# Altium schematic sheet Sheet4.SchDoc (part 2 of 3)
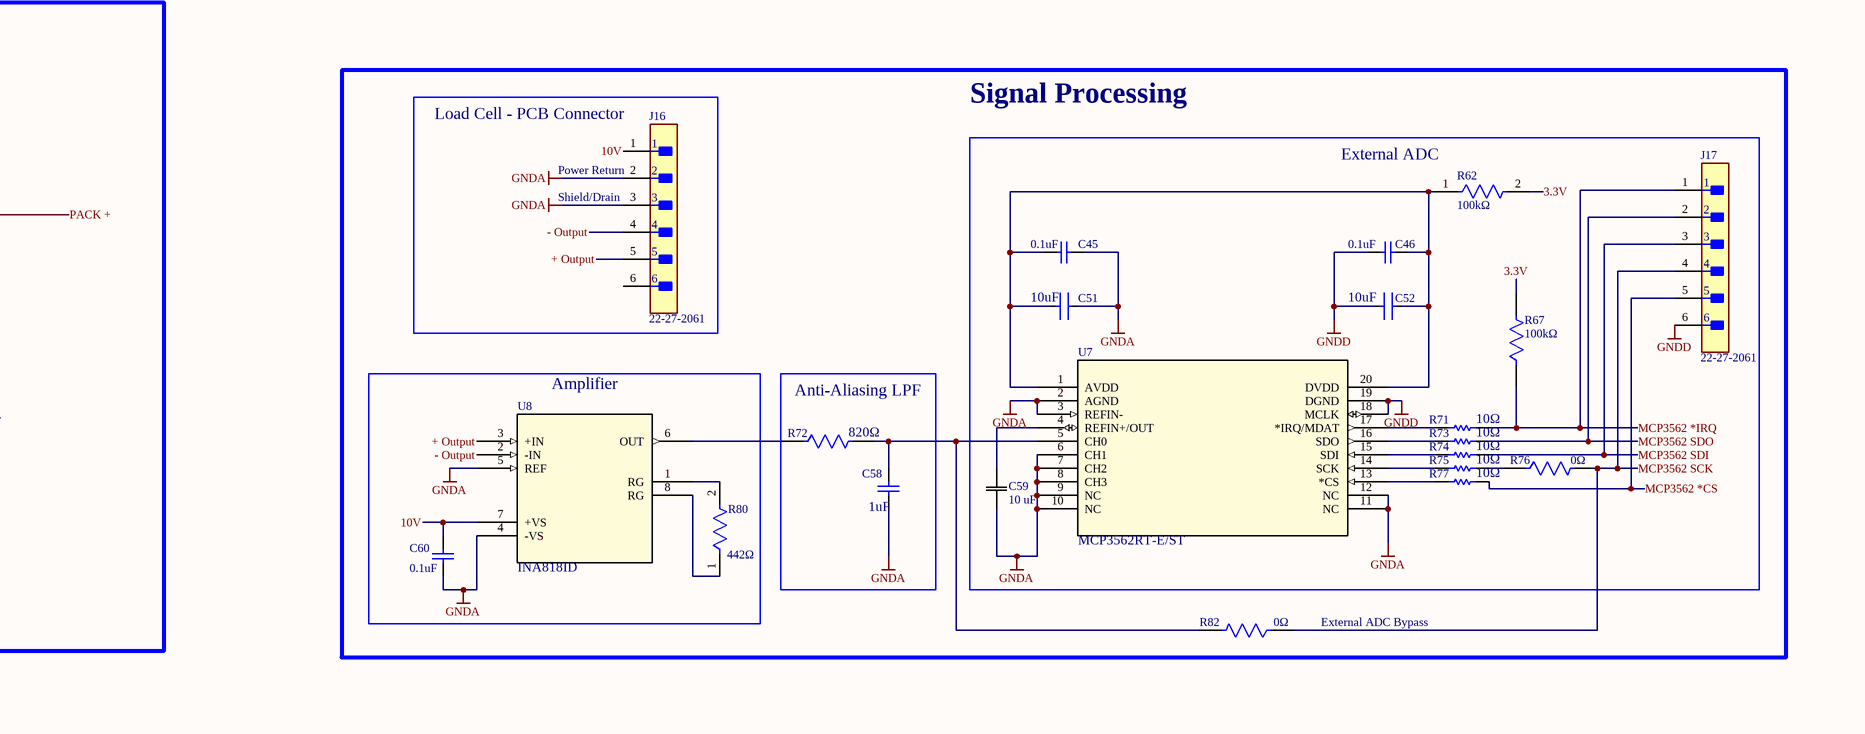
[diagram p4: Sheet4.SchDoc, bottom right]
## Library data of the parts
C1 = CMP-2007-00089-2: Ceramic Capacitor for Automotive 470nF  ±10% 25VDC X7R 0805 Paper T/R; Voltage Rating: 25V; Mount: Surface Mount; Max Operating Temperature: 125°C; Package Quantity: 1; Packaging: Tape and Reel; Height: 0.85mm; Dielectric: X7R; Case Code (Metric): 2012; Tolerance: 10%; Termination: SMD/SMT; Lead Free: Lead Free; Thickness: 0.037inch; Case Code (Imperial): 0805; Min Operating Temperature: -55°C; Length: 2mm; Capacitance: 470nF; Ratings: AEC-Q200; Radiation Hardening: No; Depth: 1.25mm; Voltage Rating (DC): 25V; Case/Package: 0805; Width: 0.049inch
C2 C12 = CMP-2007-00512-2: CAP CER 100PF 100V C0G/NP0 0805; Manufacturer Part Number: C0805C101J1GACAUTO; Manufacturer: KEMET; Tolerance: 0.05; Temperature Coefficient: 30ppm/°C; Temperature Characteristic: C0G; Material: Ceramic; Digikey Description: CAP CER 100PF 100V C0G/NP0 0805; Automotive: No; Value: 100 pF; Temperature: -55°C to +125°C; Ipc Land Pattern Name: CAPC200125X78; Device Class L1: Passive Components; Package: C0805C-DN; Category: Cap; Temperature Range Low: -55°C; Temperature Range High: +125°C; ComponentLink2URL: https://content.kemet.com/datasheets/KEM_C1003_C0G_SMD.pdf; Octopart: https://octopart.com/c0805c101j1gacauto-kemet-22884341; ComponentLink2Description: Datasheet; RoHS: TRUE; Capacitance: 100 pF; Lead Free: Yes; Height: 0.88mm; Voltage Rating: 100 V; Device Class L2: Capacitors; Device Class L3: Ceramic Capacitors
C3 = CMP-2000-06049-2: Multilayer Ceramic Capacitors 1uF ±10% 100V X7R SMD 1206; Construction: Flat; Voltage Rating (DC): 100V; Tolerance: 10%; Package Quantity: 1; Lead Free: Lead Free; Termination: SMD/SMT; Mount: Surface Mount; Capacitance: 1uF; Case Code (Metric): 3216; REACH SVHC: No SVHC; Thickness: 0.051inch; Voltage Rating: 100V; Height: 1.6mm; Case Code (Imperial): 1206; Packaging: Tape and Reel; RoHS Compliant: Yes; Weight: 0.000571oz; Min Operating Temperature: -55°C; Case/Package: 1206; Width: 0.063inch; Length: 3.2mm; Max Operating Temperature: 125°C; Series: C; Dielectric: X7R; Voltage: 100V; Depth: 1.6mm; Resistor Type: Ceramic; Contact Plating: Tin
C4 C43 = EMK212B7225KG-T: Description; Manufacturer_Name: TAIYO YUDEN; Copyright: Copyright (C) 2025 Ultra Librarian. All rights reserved.; Manufacturer_Part_Number: EMK212B7225KG-T; Supplier 1: Future Electronics; Supplier Part Number 1: 8043977
C5 C6 C8-C10 = CMP-08246-004834-1: Multilayer Ceramic Capacitors 220nF ±10% 50V X7R SMD 0805; Dielectric: X7R; Weight: 0.000194oz; Termination: SMD/SMT; Resistor Type: Ceramic; Case Code (Metric): 2012; Number of Pins: 2; Capacitance: 220nF; REACH SVHC: No SVHC; Dielectric Material: Ceramic; Min Operating Temperature: -55°C; Depth: 1.25mm; Max Operating Temperature: 125°C; Voltage: 50V; Case Code (Imperial): 0805; Thickness: 0.057inch; Mount: Surface Mount; Voltage Rating (DC): 50V; Length: 2mm; Tolerance: 10%; Packaging: Tape and Reel; Package Quantity: 1; Case/Package: 0805; Radiation Hardening: No; Voltage Rating: 50V; Height: 1.25mm; Width: 0.049inch; Series: C; Construction: Flat; RoHS Compliant: Yes; Lead Free: Lead Free
C7 = EMK212B7105KG-T: No Description Available; Manufacturer_Name: TAIYO YUDEN; Copyright: Copyright (C) 2026 Ultra Librarian. All rights reserved.; Manufacturer_Part_Number: EMK212B7105KG-T; Supplier 1: DigiKey; Supplier Part Number 1: 587-1283-1-ND
C11 = CMP-2007-00334-2: CAP CER 0.022UF 16V X7R 0805; Manufacturer Part Number: C0805C223K4RACTU; Manufacturer: KEMET; Capacitance: 22,000 pF; Value: 22,000 pF; Temperature Coefficient: 30ppm/°C; Tolerance: 0.1; Material: Ceramic; Octopart: https://octopart.com/c0805c223k4ractu-kemet-16264534; ComponentLink2URL: https://content.kemet.com/datasheets/KEM_C1003_C0G_SMD.pdf; Digikey Description: CAP CER 0.022UF 16V X7R 0805; Mouser Description: Cap Ceramic 0.022uF 16V X7R 10% SMD 0805 125°C Paper T/R; Temperature Characteristic: X7R; Device Class L3: Ceramic Capacitors; ComponentLink2Description: Datasheet; Temperature Range High: +125°C; Temperature Range Low: -55°C; Category: Cap; Package: C0805C-DN; Automotive: No; Height: 0.88mm; Lead Free: Yes; Voltage Rating: 16 V; Temperature: -55°C to +125°C; Ipc Land Pattern Name: CAPC200125X78; RoHS: TRUE; Device Class L2: Capacitors; Device Class L1: Passive Components
C13 C15 C16 C18-C20 = CMP-06035-027865-1: Multilayer Ceramic Capacitors MLCC - SMD/SMT 0805 0.1uF 10%, 100VDC,  X7R 15%
C14 = CL32A226KAJNNNE: Capacitor: ceramic; MLCC; 22uF; 25V; X5R; Â±10%; SMD; 1210; -55Ã·85Â°C; MF: Samsung Electro-Mechanics; SnapEDA_Link: https://www.snapeda.com/parts/CL32A226KAJNNNE/Samsung/view-part/?ref=snap; Package: SMD-2 Samsung; Value: *; MP: CL32A226KAJNNNE; Check_prices: https://www.snapeda.com/parts/CL32A226KAJNNNE/Samsung/view-part/?ref=eda; Supplier 1: Avnet; Supplier Part Number 1: CL32A226KAJNNNE
C17 = CL31B225KAHNNNE: Manufacturer_Name: Samsung; Part Reference: C6; PCB Footprint: CAP_CL31_SAM; Copyright: Copyright (C) 2025 Ultra Librarian. All rights reserved.; Manufacturer_Part_Number: CL31B225KAHNNNE; Value: 2.2 uF; Part Number: CL31B225KAHNNNE; Manufacturer Part Number: CL31B225KAHNNNE; Manufacturer Name: Samsung; Supplier 1: Avnet; Supplier Part Number 1: CL31B225KAHNNNE
C21 C22 C49 C53 C61 C64-C67 = CMP-1037-04668-1: CAP 1uF 6.3V ±10% 1206 (3216 Metric) Thickness 1.45mm SMD; Case-Metric: 3216; Case-EIA: 1206; Tolerance: Â±10%; Technology: SMT; Value: 1uF; Max Thickness: 1.45 mm; Rated Voltage: 6.3 V
C23 C24 C30-C33 = CMP-2007-01878-1: Manufacturer: Vitramon; Part Number: VJ0805Y104MXXMT
C25 = CMP-001-00010-6: Chip Capacitor, 1 uF, +/-10%, 25 V, 0805 (2012 Metric); Voltage Rating: 25V; Capacitor Type: Ceramic; Tolerance: 10%; Pins: 2; Max Operating Temperature: 125°C; Min Operating Temperature: -55°C; Mounting Technology: SM; RoHS Compliant: True; Case/Package: 0805
C26 C34 = CMP-001-00080-4: Chip Capacitor, 4.7µF +/-40%, 25V, 0805, Thickness 1.45 mm; Tolerance: 20%; Mounting Technology: SMT; Max Operating Temperature: 85°C; Min Operating Temperature: -55°C; Voltage Rating: 25V; Case/Package: 0805; Pins: 2
C27 C28 C35 C36 = CMP-1036-00967-1: CAP 12pF 100V ±10% 0805 (2012 Metric) Thickness 1.45mm SMD; Case-Metric: 2012; Case-EIA: 0805; Tolerance: Â±10%; Value: 12pF; Rated Voltage: 100 V; Technology: SMT; Max Thickness: 1.45 mm
C29 = CMP-03020-034663-1: CAP CER 10UF 25V X5R 0805; Dissipation Factor: 10%; Dielectric Material: Ceramic; RoHS Compliant: Yes; Voltage Rating: 25V; Case Code (Metric): 2012; Case Code (Imperial): 0805; Capacitance: 10uF; Lead Free: Lead Free; Dielectric: X5R; Depth: 1.25mm; Case/Package: 0805; Height: 1.25mm; Length: 0.079inch; Termination: Solder; Thickness: 0.057inch; Tolerance: 10%; Min Operating Temperature: -55°C; Width: 0.049inch; Mount: Surface Mount; Voltage Rating (DC): 25V; REACH SVHC: No SVHC; Voltage: 25V; Packaging: Cut Tape; Max Operating Temperature: 85°C
C37 = CMP-03020-014259-1: CAP CER 0.8PF 250V C0G/NP0 0805; Manufacturer: KEMET; Manufacturer Part Number: CBR08C808BAGAC; Temperature Characteristic: C0G; Material: Ceramic; Tolerance: 0.1 pF; Temperature Coefficient: 30ppm/°C; Digikey Description: CAP CER 0.8PF 250V C0G/NP0 0805; Height: 0.95mm; Mouser Description: Multilayer Ceramic Capacitors MLCC - SMD/SMT 250volts .8pF C0G 0805 .1pF Tol RF; ComponentLink2Description: Datasheet; Device Class L2: Capacitors; Package: CBR08C; Octopart: https://octopart.com/cbr08c808bagac-kemet-23841679; Voltage Rating: 250 V; Device Class L1: Passive Components; Automotive: No; Temperature: -55°C to +125°C; RoHS: TRUE; Category: Cap; Ipc Land Pattern Name: CAPC200125X85; Device Class L3: Ceramic Capacitors; Value: 0.8 pF; ComponentLink2URL: https://content.kemet.com/datasheets/KEM_C1030_CBR_SMD.pdf; Temperature Range Low: -55°C; Capacitance: 0.8 pF; Lead Free: Yes; Temperature Range High: +125°C
C38 = CMP-1036-00071-2: CAP 1pF 100V ±0.1pF 0805 (2012 Metric) Thickness 1.45mm SMD; Case-Metric: 2012; Tolerance: Â±0.1pF; Case-EIA: 0805; Technology: SMT; Max Thickness: 1.45 mm; Value: 1pF; Rated Voltage: 100 V
C39 C40 = CMP-1036-00537-1: CAP 4.7pF 25V ±0.1pF 0805 (2012 Metric) Thickness 0.75mm SMD; Tolerance: Â±0.1pF; Case-EIA: 0805; Case-Metric: 2012; Technology: SMT; Rated Voltage: 25 V; Max Thickness: 0.75 mm; Value: 4.7pF
C41 C42 C47 C48 C56 C59 C62 = CL31B106KAHNNNE: Description; Manufacturer_Name: Samsung; Copyright: Copyright (C) 2025 Ultra Librarian. All rights reserved.; Manufacturer_Part_Number: CL31B106KAHNNNE; Supplier 1: Avnet; Supplier Part Number 1: CL31B106KAHNNNE
C44 C50 C54 C55 C57 C63 = CMP-1037-04191-3: CAP CER 0.1UF 25V X7R 1206; Manufacturer Part Number: CC1206KRX7R8BB104; Manufacturer: Yageo; Value: 100 nF; Material: Ceramic; Tolerance: 0.1; Automotive Grade: NA; Temperature Coefficient: 15%; Category: Cap; Voltage Rating: 25 V; Temperature Range Low: -55°C; Lead Free: Yes; Mouser Description: Multilayer Ceramic Capacitors MLCC - SMD/SMT 100nF 25V X7R 10%; Octopart: https://octopart.com/cc1206krx7r8bb104-yageo-42334534; Device Class L1: Passive Components; Capacitance: 100 nF; RoHS: TRUE; Automotive: No; Package: CC1206-1.25; Device Class L2: Capacitors; Footprint Url: http://www.yageo.com/exep/pages/download/literatures/UPY-C_GEN_24.pdf; Height: 1.45mm; Temperature: -55°C to +125°C; Temperature Range High: +125°C; ComponentLink2URL: http://www.yageo.com/documents/recent/UPY-NP0X7R_HV_1KV-to-3KV_11.pdf; Temperature Characteristic: X7R; Device Class L3: Ceramic Capacitors; Digikey Description: CAP CER 0.1UF 25V X7R 1206; ComponentLink2Description: Datasheet
C45 C46 C60 = CMP-2007-01227-1: Manufacturer: Kemet; Part Number: C0805S104K5RACTU
C51 C52 = CMP-2000-06106-2: CAP CER 10UF 16V X7R 0805; Manufacturer Part Number: CL21B106KOQNNNE; Manufacturer: Samsung Electro-Mechanics America, Inc; Material: Ceramic; Tolerance: 10%; Temperature Coefficient: 15%; Digikey Description: CAP CER 10UF 16V X7R 0805; Lead Free: Yes; ComponentLink2URL: http://www.samsungsem.com/servlet/FileDownload?path=productsearch&sname=CL21B106KOQNNNE.pdf&oname=CL21B106KOQNNNE.pdf; ComponentLink2Description: Datasheet; Temperature Range Low: -55°C; RoHS: TRUE; Category: Cap; Temperature Characteristic: X7R; Automotive: No; Octopart: https://octopart.com/cl21b106koqnnne-samsung-19832289; Device Class L3: Ceramic Capacitors; Temperature Range High: +125°C; Height: 1.4mm; Device Class L2: Capacitors; Voltage Rating: 16V; Value: 10uF; Temperature: -55°C to +125°C; Device Class L1: Passive Components; Ipc Land Pattern Name: CAPC200125X125; Package: CL21B106KOQNNNE; Capacitance: 10uF
C58 = CMP-1036-04746-2: Manufacturer: Kemet; Part Number: C0805C105K4PACTU
D1 D2 D9 = CMP-0303-00004-1: Surface Mount Schottky Barrier Diode, 100 V, -55 to 125 degC, 2-Pin SOD123, RoHS, Tape and Reel; Manufacturer: Diodes Inc; IR@1.5 V: 0.3 uA Max.; V(BR)R: 100 V Min.; VF@10 mA: 0.45 V Max.; CT@1 V: 12 pF Typ.; PartNumber: BAT46W-7-F; ComponentLink1URL: http://www.diodes.com/; ComponentLink3URL: http://diodes.com/datasheets/ds30044.pdf; PackageDescription: 2-Pin SMD, Body 2.7 x 1.55 mm, Height 1.45 mm; ComponentLink2Description: Datasheet; ComponentLink3Description: Package Specification; Mounting Technology: Surface Mount; ComponentLink1Description: Manufacturer URL; RoHS: TRUE; Operating Temperature: -55 to 125 degC; Packing: Tape and Reel; ComponentLink2URL: http://diodes.com/datasheets/ds30044.pdf; DatasheetVersion: Rev. 16-2
D3 = CMP-1426-00001-4: LED Low-Power Uni-Color Red 630nm 2V 2-Pin Chip 0603(1608Metric) T/R; Max Junction Temperature (Tj): 95°C; Dominant Wavelength: 625nm; Lens Style: Clear, Rectangular; Viewing Angle: 140°; Forward Current: 100mA; Max Reverse Voltage (DC): 5V; Luminous Intensity: 250mcd; Test Current: 20mA; Power Dissipation: 72mW; Max Operating Temperature: 85°C; Mount: Surface Mount; Height: 700µm; Packaging: Tape and Reel; REACH SVHC: Unknown; Case Code (Metric): 1608; Peak Wavelength: 630nm; Forward Voltage: 2V; Case/Package: 0603; Color: Red; RoHS: Compliant; Width: 800µm; Reverse Voltage: 5V; Min Operating Temperature: -40°C; Wavelength: 625nm; Case Code (Imperial): 0603; Length: 1.6mm
D4 = CMP-1060-00438-1: Zener Voltage Regulator, 500 mW, 2-Pin SOD-123, Pb-Free, Tape and Reel; Manufacturer: On Semiconductor; VZ Typ (V): 10; P Max (W): 0.5; ComponentLink3Description: Package Specification; ComponentLink3URL: http://www.onsemi.com/pub_link/Collateral/425-04.PDF; ComponentLink2Description: Datasheet; Packing: Tape and Reel; RoHS: Pb-Free; DatasheetVersion: Rev. 9; PackageVersion: Rev. G, 10/2009; ComponentLink2URL: http://www.onsemi.com/pub_link/Collateral/MMSZ4678T1-D.PDF; ComponentLink1URL: http://www.onsemi.com/; PackageReference: SOD-123-2-425-04; PackageDescription: 2-Pin SOD, Body 1.6 x 2.69 mm; PartNumber: MMSZ4697T1G; Mounting Technology: Surface Mount; ComponentLink1Description: Manufacturer URL
D5-D7 = CMP-0931-00032-1: Small Signal Zener Diode, 16 V +/- 5%, -55 to 155 degC, 2-Pin SOD-123, RoHS, Tape and Reel; Manufacturer: Vishay Semiconductor; Test Current (IZT1) (mA): 7.8; Zener Impedance (IZT1) (Max.) (Ohm): 17; Int. Construction: Single; Tolerance: +/- 5%; Power Dissipation (mW): 500; Zener Voltage (NOM.) (V): 16; ComponentLink1URL: http://www.vishay.com/; PackageReference: SOD-123-2; PartNumber: MMSZ5246B-E3-08; ComponentLink2Description: Datasheet; Operating Temperature: -55 to 150 degC; PackageDescription: 2-Pin SMD, Body 2.7 x 1.55 mm, Height 1.35 mm; ComponentLink2URL: http://www.vishay.com/docs/85774/mmsz5225.pdf; DatasheetVersion: Rev. 1.9; RoHS: TRUE; Packing: Tape and Reel; ComponentLink1Description: Manufacturer URL; Mounting Technology: Surface Mount; PackageVersion: Rev. 1.9; ComponentLink3URL: http://www.vishay.com/docs/85774/mmsz5225.pdf; ComponentLink3Description: Package Specification
D8 = CMP-2000-04932-2: Fast Switching Diode, 100 V, 0.15 A, -65 to 150 degC, 2-Pin?SOD123, RoHS, Tape and Reel; Recovery Time: 4ns; Brand: DiodesIncorporated; Unit Weight: 0.000353oz; Max Surge Current: 2A; Peak Reverse Voltage: 100V; Ir - Reverse Current: 1uA; Vf - Forward Voltage: 1.25V; Configuration: Single; If - Forward Current: 0.15A; Product Category: Diodes-GeneralPurpose,Power,Switching; Operating Temperature Range: -65Cto+150C; Packaging: Reel; Manufacturer URL: http://www.diodes.com/; Maximum Operating Temperature: +150C; Height: 1.25mm; Minimum Operating Temperature: -65C; Product: SwitchingDiodes; Package URL: http://www.diodes.com/datasheets/ds18004.pdf; Type: SwitchingDiode; Package Reference: SOD123-2; Width: 1.7mm; Datasheet URL: http://www.farnell.com/datasheets/1915529.pdf; Datasheet Version: Rev. 24-2, 10/2013; Series: 1N4148; Factory Pack Quantity: 3000; Length: 2.85mm; RoHS: True; Manufacturer: DiodesIncorporated; Mounting Style: SMD/SMT; Package / Case: SOD-123
D10 = CMP-1055-00390-1: Schottky Power Rectifier, 2-Pin SMC, Pb-Free, Tape and Reel; Manufacturer: On Semiconductor; Configuration: Single; IFSM Max (A): 190; ComponentLink1URL: http://www.onsemi.com/; ComponentLink3URL: http://www.onsemi.com/pub_link/Collateral/403-03.PDF; ComponentLink1Description: Manufacturer URL; PackageVersion: Rev. E, 08/2005; Packing: Tape and Reel; ComponentLink2URL: http://www.onsemi.cn/pub_link/Collateral/MBRS540T3-D.PDF; RoHS: TRUE; DatasheetVersion: Rev. 8; Mounting Technology: Surface Mount; ComponentLink3Description: Package Specification; ComponentLink2Description: Datasheet; PartNumber: MBRS540T3G; PackageDescription: 2-Pin Small Molded Package, J-Bend Lead, Body 5.845 x 6.855 mm; PackageReference: SMC-2-403-03
D11 = BAT54: Schottky, SOT-23, 30V, 0.2A, 150C; Part Reference: D1; PCB Footprint: SOT95P240X120-3N; MF: Diotec; OriginalSymbolOrigin: (-10000,20000); Value: BAT54; SnapEDA_Link: https://www.snapeda.com/parts/BAT54/Diotec/view-part/?ref=snap; Package: SOT-23 Diotec; MP: BAT54; Check_prices: https://www.snapeda.com/parts/BAT54/Diotec/view-part/?ref=eda; Part Number: BAT54; Manufacturer Part Number: BAT54; Manufacturer Name: Diotec; Supplier 1: Avnet
D12 D13 = TLLR4400: 3MM LED RED LC TINT. DIFF-e3; Manufacturer_Name: Vishay; Copyright: Copyright (C) 2025 Ultra Librarian. All rights reserved.; Manufacturer_Part_Number: TLLR4400; Supplier 1: Avnet; Supplier Part Number 1: 33C1369
D14 = CMP-2000-05927-2: DIODE SCHOTTKY 40V 300MA SOD323; Manufacturer: STMicroelectronics; Max Surge Forward Current: 1.25A; Value: 7pF; Max Junction Temp: +150°C; Peak Reverse Current: 1uA; Standoff Height: 0mm; ComponentLink2Description: Datasheet; Device Class L2: Diodes; Mouser Description: Schottky Diodes & Rectifiers 300mA 40 Volt; Forward Current: 300mA; Temperature Range Low: -40°C; Temperature Range High: +150°C; Digikey Description: DIODE SCHOTTKY 40V 300MA SOD323; Capacitance: 7pF; Ipc Land Pattern Name: SOD250128X117-2; Automotive: No; Manufacturer Part Number: BAT54JFILM; Device Class L1: Discrete Semiconductors; Lead Free: Yes; ComponentLink2URL: https://www.st.com/resource/en/datasheet/bat54.pdf; Package: SOD323; Temperature: -40°C to +150°C; Category: IC; Height: 1.17mm; Octopart: https://octopart.com/bat54jfilm-stmicroelectronics-326073; RoHS: TRUE; Device Class L3: Schottky Diodes; Max Repetitive Reverse Voltage: 40V
E1 = CMP-176-000001-1: 2.4GHz - Chip RF Antenna 2.4GHz ~ 2.5GHz 0.5dBi Solder Surface Mount; MF: Johanson Technology; Source: 2450AT18B100E.SchLib; Price: None; Package: None; Component Type: Standard; MP: 2450AT18B100E; Check_prices: https://www.snapeda.com/parts/2450AT18B100E/Johanson+Technology+Inc./view-part/?ref=eda; Design Item ID: 2450AT18B100E; SnapEDA_Link: https://www.snapeda.com/parts/2450AT18B100E/Johanson+Technology+Inc./view-part/?ref=snap; Availability: In Stock; Pin Count: 2; Value: *; Purchase-URL: https://pricing.snapeda.com/search/part/2450AT18B100E/?ref=eda
J1 = CMP-1502-03324-3: Terminal Block, 5MM Pitch, Horizontal, Pressure Clamp Glow Wire, Pcb, 2PINS, Gr; Current Rating: 16A; Number of Contacts: 2; Voltage Rating: 300V; Number of Pins: 2; Min Operating Temperature: -30°C; Lead Pitch: 5mm; Packaging: Box; Max Operating Temperature: 120°C; RoHS: Compliant; Number of Rows: 1; Height: 11.6mm; Contact Material: Nickel, Tin
J2 = CMP-17439-000304-1: CONN HEADER VERT 5POS 2.5MM; Mated Stacking Heights: 9.8mm; Voltage Rating: 250V; Max Current Rating: 3A; Number of Positions: 5; Contact Resistance: 20mR; Depth: 5.75mm; Connector Type: Header; Color: Green; Insulation Material: Nylon; Contact Plating: Copper; Length: 14.9mm; Fastening Type: Detent; Contact Material: Brass; Number of Rows: 1; Contact Type: Male Pin; Housing Material: Polyamide; Housing Color: White; Lead Free: Lead Free; Max Voltage Rating (AC): 250V; Mount: Through Hole; Contact Shape: Square; Min Operating Temperature: -25°C; Packaging: Bulk; Orientation: Straight; Insulation Color: Natural; Series: XH; Flammability Rating: UL94 V-0; Contact Finish - Mating: TIN; Max Operating Temperature: 85°C; Termination: Solder; Pitch: 2.5mm
J3 J19 J23 = PPPC031LFBN-RC: Description; Manufacturer_Name: Sullins; Copyright: Copyright (C) 2025 Ultra Librarian. All rights reserved.; Manufacturer_Part_Number: PPPC031LFBN-RC; RefDes: RefDes; Type: Type; Supplier 1: DigiKey; Supplier Part Number 1: S7036-ND
J4-J11 J18 J21 = PPPC021LFBN-RC: Description; Manufacturer_Name: Sullins; Copyright: Copyright (C) 2025 Ultra Librarian. All rights reserved.; Manufacturer_Part_Number: PPPC021LFBN-RC; RefDes: RefDes; Type: Type; Supplier 1: DigiKey; Supplier Part Number 1: S7035-ND
J12 J22 = PPTC041LFBN-RC: 4 Position Header Connector 0.100 (2.54mm) Through Hole Tin; MF: Sullins Connector; SnapEDA_Link: https://www.snapeda.com/parts/PPTC041LFBN-RC/Sullins/view-part/?ref=snap; Package: None; Value: *; MP: PPTC041LFBN-RC; Check_prices: https://www.snapeda.com/parts/PPTC041LFBN-RC/Sullins/view-part/?ref=eda
  J12: Supplier 1: DigiKey; Supplier Part Number 1: S7002-ND
J13 J14 J16 J17 = CMP-04776-000309-1: CONN HEADER VERT 6POS 2.54MM; Number of Contacts: 6; Current Rating: 4A; Voltage Rating (AC): 250V; Contact Resistance: 10mR; Hole Diameter: 1.02mm; Connector Type: Male Pin; Gender: Male; Mount: Through Hole; REACH SVHC: No SVHC; Number of Rows: 1; Contact Plating: Tin; Series: KK; Depth: 5.8mm; Flammability Rating: UL94 V-0; Contact Type: Male Pin; Lead Pitch: 2.54mm; Min Operating Temperature: 0°C; Pitch: 2.54mm; Radiation Hardening: No; Color: Natural; Length: 15.24mm; Termination: Solder; Orientation: Straight; Contact Material: Brass; Max Voltage Rating (AC): 250V; Housing Material: Nylon; Max Operating Temperature: 75°C; Working Voltage: 250V; Max Current Rating: 4A; Fastening Type: Friction; Voltage Rating: 250V; Housing Color: White; Packaging: Bulk; Material: Nylon; Contact Mating Length: 0.295inch; Package Quantity: 10000; Number of Positions: 6
J15 = CMP-002-00034-1: Male Header, Pitch 2.5 mm, 1 x 4 Position, Height 6.1 mm, Tail Length 3.4 mm, -25 to 85 degC, RoHS, Bulk; Manufacturer: JST; RoHS Compliant: Unknown; Manufacturer URL: http://www.jst.com/home2.html; Connector Type: Header; Datasheet URL: http://www.jst-mfg.com/product/pdf/eng/eXH.pdf; Gender: Male; Package Reference: S4B-XH-A(LF)(SN); Datasheet Version: May-16; Case/Package: S4B-XH-A(LF)(SN); Mounting Technology: TH; Max Operating Temperature: 85°C; Min Operating Temperature: -25°C; Package Description: XH Series Disconnectable Crimp Style Connector, Pitch 2.5 mm, 1 x 4 Position, Height 6.1 mm, Tail Length 3.4 mm
J20 = 1054500101: Universal Serial Bus (USB) Shielded I/O Receptacle, Type C, Right-Angle, Top Mount, Surface Mount, 0.80mm Solder Tabs, Gold (Au) Flash over 0.76m Palladium Nickel Plating; Manufacturer_Name: Molex Connector Corporation; Part Reference: J3; PCB Footprint: CONN_105450-0101_MOL; Copyright: Copyright (C) 2025 Ultra Librarian. All rights reserved.; Manufacturer_Part_Number: 1054500101; Datasheet: https://www.molex.com/en-us/products/part-detail-pdf/1054500101?display=pdf; Value: CONN_105450-0101; Part Number: 1054500101; Manufacturer Part Number: 1054500101; Manufacturer Name: Molex Connector Corporation; Supplier 1: Avnet; Supplier Part Number 1: 1054500101
L1 = CMP-14484-000105-1: SMD Inductors 100uH ±10% 0.34A 1.82Ω 1210; Shielding: Unshielded; Max DC Current: 340mA; Saturation Current: 270mA; Self Resonant Frequency: 6MHz; Test Frequency: 100kHz; DC Resistance (DCR): 1.82R; Core Material: Ferrite; Width: 0.098inch; Tolerance: 10%; Max Operating Temperature: 105°C; Height - Seated (Max): 0.106inch; Inductance Tolerance: 10%; Height: 2.5mm; Case/Package: 1210; Min Operating Temperature: -40°C; Radiation Hardening: No; Inductance: 100uH; DC Current: 340mA; Current Rating: 340mA; Halogen Free: Halogen Free; Package Quantity: 1; RoHS Compliant: Yes; Case Code (Imperial): 1210; Packaging: Tape and Reel; Termination: SMD/SMT; Series: CB; Length: 0.126inch; Resistor Type: Wirewound; Mount: Surface Mount; Military Standard: Not; Depth: 2.7mm; Lead Free: Lead Free; Case Code (Metric): 3225
L2 = CMP-08253-000052-1: Shielded Multilayer Inductor 10uH ±20% 500mA 390mΩ SMD 0805; Self Resonant Frequency: 50MHz; Core Material: Ferrite; Test Frequency: 2MHz; Saturation Current: 110mA; DC Resistance (DCR): 390mR; Current Rating: 500mA; Case Code (Metric): 2012; Package Quantity: 1; RoHS Compliant: Yes; Tolerance: 20%; Height - Seated (Max): 0.057inch; Case/Package: 0805; Width: 0.049inch; Mount: Surface Mount; Max Operating Temperature: 125°C; Inductance: 10uH; Packaging: Tape and Reel; Length: 0.079inch; Min Operating Temperature: -55°C; Case Code (Imperial): 0805; Shielding: Shielded
L3 = CMP-06042-005429-1: Wire Wound RF Inductor 15nH ±10% 1000mA 0.04Ω 0805 (2015); Current Rating: 1A; Q Factor: 40; Test Frequency: 100MHz; Core Material: Non-Magnetic; Self Resonant Frequency: 3.1GHz; Shielding: Unshielded; DC Resistance (DCR): 40mR; Mount: Surface Mount; Depth: 1.7mm; Case Code (Metric): 2015; Height - Seated (Max): 0.07inch; Max Operating Temperature: 85°C; Max DC Current: 1A; Weight: 0.000317oz; Length: 2mm; Radiation Hardening: No; DC Current: 1A; Military Standard: Not; Inductance: 15nH; Tolerance: 10%; Termination: SMD/SMT; Case/Package: 0805; Case Code (Imperial): 0805; Width: 0.059inch; Resistor Type: Wirewound; Height: 1.7mm; Min Operating Temperature: -40°C; Packaging: Tape and Reel; Package Quantity: 2000
L4 L7 = CMP-06042-006078-1: Wire Wound RF Inductor 3.3nH ±0.5nH 1700mA 0.02Ω 0805 (2015); Test Frequency: 100MHz; DC Current: 1.7A; Shielding: Unshielded; Self Resonant Frequency: 6GHz; Core Material: Non-Magnetic; DC Resistance (DCR): 20mR; Q Factor: 10; Case Code (Metric): 2015; Max Operating Temperature: 85°C; Packaging: Tape and Reel; Radiation Hardening: No; Max DC Current: 1.7A; Height: 1.7mm; Resistor Type: Wirewound; Package Quantity: 2000; Case Code (Imperial): 0805; Military Standard: Not; Min Operating Temperature: -40°C; Termination: SMD/SMT; Length: 0.079inch; Current Rating: 1.7A; Inductance: 3.3nH; Case/Package: 0805; Width: 0.059inch; Weight: 0.000317oz; Height - Seated (Max): 0.07inch; Depth: 1.7mm; Mount: Surface Mount
L5 = CMP-06042-001687-1: Wire Wound RF Inductor 2.7nH ±0.5nH 1900mA 0.02Ω 0805 (2015); Max DC Current: 1.9A; Test Frequency: 100MHz; DC Resistance (DCR): 20mR; Core Material: Non-Magnetic; Shielding: Unshielded; Self Resonant Frequency: 6GHz; Q Factor: 20; Min Operating Temperature: -40°C; Mount: Surface Mount; DC Current: 1.9A; Packaging: Tape and Reel; Case Code (Metric): 2012; Weight: 0.000317oz; Height: 1.7mm; Case/Package: 0805; Depth: 1.7mm; Current Rating: 1.9A; Length: 2mm; Radiation Hardening: No; Width: 0.059inch; Max Operating Temperature: 85°C; Case Code (Imperial): 0805; Height - Seated (Max): 0.07inch; Termination: SMD/SMT; Package Quantity: 2000; Inductance: 2.7nH; Resistor Type: Wirewound; Military Standard: Not
L6 = CMP-02424-000558-1: Commercial Inductors, High Saturation Series 3.3uH 15A 9.2mΩ 20%; Core Material: Ferrite; Self Resonant Frequency: 5MHz; Shielding: Shielded; Saturation Current: 32A; DC Resistance (DCR): 9.2mR; Test Frequency: 100kHz; Number of Pins: 5050; Max Operating Temperature: 125°C; Height: 5mm; Tolerance: 20%; Max DC Current: 15A; Inductance Tolerance: 20%; Radiation Hardening: No; Inductance: 3.3uH; Lead Free: Lead Free; Length: 13.2mm; RMS Current (Irms): 15A; Military Standard: Not; Case/Package: 5050; Current Rating: 15A; Depth: 12.9mm; Height - Seated (Max): 0.197inch; Termination: SMD/SMT; Mount: Surface Mount; Width: 12.9mm; Packaging: Tape and Reel; Package Quantity: 250; Min Operating Temperature: -55°C
NT1 NT2 = CMP-009-00121-1: Max Operating Temperature: 155°C; Min Operating Temperature: -55°C; Pins: 2
Q1 = CMP-14406-000018-1: TRANS NPN 150V 1A SOT89; Manufacturer Part Number: PBHV8115X,115; Manufacturer: Nexperia; Number Of Npn: 1; Rise Time Tr: 565ns; Delay Time Td: 7ns; Rthja Max: 240K/W; Emitter Base Voltage: 6V; Hfe Testvce: 10V; Collector Emitter Saturation Voltage: 33mV; Hfe Min: 10; Max Junction Temp: +150°C; Gain Bandwidth Product: 30MHz; Automotive Grade: Grade 0; Power Dissipation: 0.52W; Collector Base Voltage: 400V; Fall Time Tf: 700ns; Category: Trans; Lead Free: Yes; Number Of Elements: 1; Ambient Temperature Range Low: -55°C; Height: 1.6mm; Temperature: to +150°C; Max Collector Current: 1A; Device Class L3: BJTs; ComponentLink2URL: https://assets.nexperia.com/documents/data-sheet/PBHV8115X.pdf; Collector Emitter Voltage: 150V; Device Class L1: Discrete Semiconductors; Package: SOT89; Storage Time Ts: 1530ns; Ambient Temperature Range High: +150°C; Digikey Description: TRANS NPN 150V 1A SOT89; ComponentLink2Description: Datasheet; Footprint Url: https://assets.nexperia.com/documents/outline-drawing/SOT89.pdf; Device Class L2: Transistors; RoHS: TRUE; Automotive: Yes; Temperature Range High: +150°C; Octopart: https://octopart.com/pbhv8115x%2C115-nexperia-78740688; Hfe Testic: 1A
Q2 Q3 = CMP-04962-000007-1: MOSFET N-CH 100V 100A 8SON; Manufacturer: Texas Instruments; Depletion Mode: False; Number Of Channels: 1; Gate To Source Voltage: 20V; Reverse Recovery Time: 80ns; Input Capacitace At Vds: 3700pF @ 50V; Max Forward Diode Voltage: 1V; Turn Off Delay Time: 22ns; Drain To Source Resistance: 4.6mΩ; Threshold Vgs Max: 3.2V; Max Junction Temp: +150°C; Turn On Delay Time: 7ns; Pulse Drain Current: 400A; Rthja Max: 50°C/W; Typ Forward Diode Voltage: 0.8V; Reverse Recovery Charge: 249nC; Threshold Vgs Min: 2.2V; Gate Charge At Vgs: 48nC @ 10V; Power Dissipation: 3.1W; Transconductance: 84S; Temperature Range Low: -55°C; Automotive: No; RoHS: TRUE; Temperature: -55°C to +150°C; Device Class L3: MOSFETs; Continuous Drain Current: 100A; Number Of N Channels: 1; Height: 1.05mm; Mouser Description: MOSFET 100V 4.0 mOhm N-Ch NexFET Power MOSFET; Drain To Source Voltage: 100V; Temperature Range High: +150°C; Manufacturer Part Number: CSD19532Q5B; Octopart: https://octopart.com/csd19532q5b-texas+instruments-32890191; ComponentLink2URL: http://www.ti.com/lit/ds/symlink/csd19532q5b.pdf; Lead Free: Yes; Drain To Source Breakdown Voltage: 100V; Device Class L1: Discrete Semiconductors; Device Class L2: Transistors; Package: DNK0008A; Digikey Description: MOSFET N-CH 100V 100A 8SON; Category: Trans; ComponentLink2Description: Datasheet
Q4 Q8 = 2N7002: Mosfet Array 2 N-Channel (Dual) 60V 300mA 500mW Surface Mount PG-SOT363-6; MF: onsemi; SnapEDA_Link: https://www.snapeda.com/parts/2N7002/Onsemi/view-part/?ref=snap; Package: SOT-23-3 ON Semiconductor; Value: *; MP: 2N7002; Check_prices: https://www.snapeda.com/parts/2N7002/Onsemi/view-part/?ref=eda; Supplier 1: Avnet; Supplier Part Number 1: 2N7002
Q5 = CMP-12801-000027-1: MOSFET N-CH 100V 1.6A SOT-23; Manufacturer Part Number: DMN10H220L-7; Manufacturer: Diodes Inc.; Typ Forward Diode Voltage: 0.7V; Max Junction Temp: +150°C; Reverse Recovery Charge: 9.8nC; Gate Charge At Vgs: 8.3nC @ 10V; Turn Off Delay Time: 7.9ns; Depletion Mode: False; Power Dissipation: 1.3W; Rthja Max: 177°C/W; Reverse Recovery Time: 17ns; Gate To Source Voltage: 16V; Drain To Source Resistance: 250mΩ; Threshold Vgs Max: 2.5V; Turn On Delay Time: 6.8ns; Threshold Vgs Min: 1V; Pulse Drain Current: 8A; Number Of Channels: 1; Max Forward Diode Voltage: 1.2V; Standoff Height: 0.013mm; Input Capacitace At Vds: 401pF @ 25V; Continuous Drain Current: 1.4A; Device Class L2: Transistors; Automotive: No; Device Class L3: MOSFETs; Drain To Source Breakdown Voltage: 100V; Footprint Url: https://www.diodes.com/assets/Package-Files/SOT23.pdf; Package: SOT23; Lead Free: Yes; Temperature: -55°C to +150°C; Drain To Source Voltage: 100V; Device Class L1: Discrete Semiconductors; ComponentLink2URL: https://www.diodes.com/assets/Datasheets/DMN10H220L.pdf; Temperature Range High: +150°C; Temperature Range Low: -55°C; Category: Trans; Mouser Description: DMN10H220L Series 100 V 250 mOhm N-Channel Enhancement Mode Mosfet - SOT-23; RoHS: TRUE; ComponentLink2Description: Datasheet; Height: 1.1mm; Digikey Description: MOSFET N-CH 100V 1.6A SOT-23; Octopart: https://octopart.com/dmn10h220l-7-diodes+inc.-38898610; Number Of N Channels: 1
Q6 = 2N7002KW: Description; Manufacturer_Name: onsemi; Copyright: Copyright (C) 2025 Ultra Librarian. All rights reserved.; Manufacturer_Part_Number: 2N7002KW; Supplier 1: Avnet; Supplier Part Number 1: 2N7002KW
Q7 Q9 = IRLML6402TRPBF: P-Channel 20 V 3.7A (Ta) 1.3W (Ta) Surface Mount Micro3Ã¢â€žÂ¢ /SOT-23; MF: Infineon; SnapEDA_Link: https://www.snapeda.com/parts/IRLML6402TRPBF/Infineon/view-part/?ref=snap; Package: SOT-23-3 ON Semiconductor; Value: *; MP: IRLML6402TRPBF; Check_prices: https://www.snapeda.com/parts/IRLML6402TRPBF/Infineon/view-part/?ref=eda; Supplier 1: Arrow Electronics; Supplier Part Number 1: AO3419
Q10 Q11 = SIR426DP-T1-GE3: N-CHANNEL 40-V (D-S) MOSFET; Manufacturer_Name: Vishay; Copyright: Copyright (C) 2025 Ultra Librarian. All rights reserved.; Manufacturer_Part_Number: SIR426DP-T1-GE3; RefDes: RefDes; Type: Type
Q12 = STL9P3LLH6: P-channel -30 V, 12 mOhm typ., -9 A STripFET H6 Power MOSFET in a PowerFLAT 3.3 x 3.3 package; Manufacturer_Name: STMicroelectronics; Copyright: Copyright (C) 2025 Ultra Librarian. All rights reserved.; Manufacturer_Part_Number: STL9P3LLH6; RefDes: RefDes; Type: Type
R1 R14 R15 = CMP-1013-00050-2: Part Number: ERJ-6GEYJ101V; Manufacturer: Panasonic
R2 R7 R12 = CMP-2001-00336-1: Manufacturer: Panasonic; Part Number: ERJ-6GEYJ102V
R3 = CMP-02407-002320-1: RES Thick Film, 150Ω, 5%, 1W, 200ppm/°C, 2512; Voltage Rating: 500V; Resistance: 150R; Number of Pins: 2; Max Power Dissipation: 1W; Weight: 0.001429oz; Tolerance: 5%; Mount: Surface Mount; Features: Automotive AEC-Q200; Case Code (Imperial): 2512; Voltage Rating (DC): 500V; Packaging: Tape and Reel; Temperature Coefficient: 200ppm/°C; Min Operating Temperature: -55°C; Depth: 3.15mm; Contact Plating: Tin; Composition: Thick Film; Length: 6.3mm; Package Quantity: 2000; Termination: SMD/SMT; Width: 0.124inch; Max Operating Temperature: 155°C; Radiation Hardening: No; Lead Free: Lead Free; Number of Terminations: 2; Height: 0.028inch; Case Code (Metric): 6432; Case/Package: 2512; Military Standard: Not; Power Rating: 1W
R4-R6 R8 R11 = CMP-2003-01944-1: Manufacturer: Vishay Dale; Part Number: CRCW120620R0FKEA
R9 R10 R42 R88 = CMP-26527-002945-1: 1kΩ ±1% 0.125W 0805 Thick Film Chip Resistor AEC-Q200 compliant; Resistance: 1kR; Max Power Dissipation: 125mW; Temperature Coefficient: 100ppm/°C; Series: RMCF; Packaging: Tape and Reel; Depth: 1.25mm; Tolerance: 1%; Contact Plating: Tin; Height: 0.026inch; Length: 2mm; Resistor Type: Thick Film; Lead Free: Lead Free; Width: 0.049inch; Military Standard: Not; RoHS Compliant: Yes; Case/Package: 0805; Min Operating Temperature: -55°C; Mount: Surface Mount; Max Operating Temperature: 155°C; Construction: Rectangular; Features: Automotive AEC-Q200; Number of Terminations: 2; Radiation Hardening: No
R13 R18 = CMP-2003-02161-2: NexarPartId: 42274481; Voltage Rating (DC): 200V; Max Power Dissipation: 250mW; Tolerance: 5%; Resistance: 3.9kΩ; Temperature Coefficient: 200ppm/°C; Termination: SMD/SMT; Width: 1.6002mm; Contact Plating: Tin; Military Standard: Not; Features: Automotive AEC-Q200; Depth: 1.6mm; Voltage Rating: 200V; Height: 600µm; Composition: Thick Film; Case/Package: 1206; Lead Free: Lead Free; RoHS: Compliant; Case Code (Metric): 3216; Radiation Hardening: No; Length: 3.2mm; Number of Terminations: 2; Max Operating Temperature: 155°C; Packaging: Cut Tape; Number of Pins: 2; REACH SVHC: Unknown; Weight: 10.007382mg; Power Rating: 250mW; Case Code (Imperial): 1206; Min Operating Temperature: -55°C
R16 R30 = CMP-26527-000017-1: RES 0 OHM JUMPER 1/8W 0805; Power Rating: 125mW; Resistance: 0mR; Depth: 1.25mm; Length: 2mm; Military Standard: Not; Width: 0.049inch; Case Code (Imperial): 0805; Number of Terminations: 2; Mount: Surface Mount; Contact Plating: Tin; Height: 0.026inch; Case/Package: 0805; Min Operating Temperature: -55°C; Composition: Thick Film; Max Operating Temperature: 155°C; Packaging: Tape and Reel; Features: Automotive AEC-Q200; Max Power Dissipation: 125mW; Radiation Hardening: No; Lead Free: Lead Free; Case Code (Metric): 2012
R17 = PMR100HZPFV1L00: No Description Available; Manufacturer_Name: ROHM Semiconductor; Copyright: Copyright (C) 2026 Ultra Librarian. All rights reserved.; Manufacturer_Part_Number: PMR100HZPFV1L00
R19 R61 = RC2010FK-07100KL: RES, 100K, 1%, 0.75W, 2010, THICK FILM; Resistor Case Style:2010 [5025 Metric]; Resistance:100kohm; Product Range:RC Series; Voltage Rating:200V; Resistor Element Material:Thick Film; Power Rating:750mW; Resistance Tolerance:Â± 1%; Temperature Coefficient; MF: Yageo Corporation; MP: RC2010FK07100KL; SnapEDA_Link: https://www.snapeda.com/parts/RC2010FK07100KL/Yageo/view-part/?ref=snap; Package: 2010-2 YAGEO; Value: *; Check_prices: https://www.snapeda.com/parts/RC2010FK07100KL/Yageo/view-part/?ref=eda; Supplier 1: Newark; Supplier Part Number 1: RC2010FK-07100KL
R20 R28 R84 = CMP-03211-002267-1: CRGCQ0805 470Ω 0.125W ±100ppm/°C 5% 150V; Manufacturer: TE Connectivity; Manufacturer Part Number: CRGCQ0805J470R; Tolerance: 0.05; Automotive Grade: Grade 610; Temperature Range Low: -55°C; Power Rating: 0.125W; Temperature: -55°C to +155°C; Height: 0.65mm; Temperature Coefficient: ±100ppm/°C; Resistance: 470Ω; Composition: Thick Film; Ambient Temperature Range High: +70°C; Category: Res; Value: 470Ω; Automotive: Yes; Series: CRGCQ; Package: CRGCQ0805; Device Class L3: Chip SMD Resistors; ComponentLink2URL: https://www.te.com/commerce/DocumentDelivery/DDEController?Action=showdoc&DocId=Data+Sheet%7F1773204-3%7F1%7Fpdf%7FEnglish%7FENG_DS_1773204-3_1.pdf%7F4-2176341-619; Device Class L2: Resistors; Octopart: https://octopart.com/crgcq0805j470r-te+connectivity-91018229; Voltage Rating: 150V; Ipc Land Pattern Name: RESC200125X55; Temperature Range High: +155°C; Device Class L1: Passive Components; ComponentLink2Description: Datasheet; RoHS: TRUE; Lead Free: Yes
R21 R31 R32 R35-R39 = CMP-2003-02296-2: RES Thick Film, 5.1kΩ, 5%, 0.25W, 200ppm/°C, 1206; Resistance: 5.1kR; Voltage Rating: 200V; Power Rating: 250mW; Packaging: Tape and Reel; Min Operating Temperature: -55°C; Max Operating Temperature: 155°C; Package Quantity: 1; Lead Free: Lead Free; Working Voltage: 200V; Case Code (Metric): 3216; Case Code (Imperial): 1206; Composition: Thick Film; Temperature Coefficient: 200ppm/°C; Voltage Rating (DC): 200V; Features: Automotive AEC-Q200; Military Standard: Not; Width: 0.063inch; Weight: 0.000353oz; Height: 0.55mm; Max Power Dissipation: 250mW; Depth: 1.6mm; Termination: SMD/SMT; Number of Terminations: 2; Case/Package: 1206; Radiation Hardening: No; Tolerance: 5%; Length: 3.2mm; Contact Plating: Tin
R22 R34 R56 = RC2010JK-0710KL: Package: None; Price: None; Value: *; MP: RC2010JK-0710KL; Availability: Unavailable; Supplier 1: Avnet; Supplier Part Number 1: 49AK3933
R23 = CMP-2001-00371-1: Manufacturer: Panasonic; Part Number: ERJ-6GEYJ203V
R24-R26 = CMP-26527-000232-1: 10MΩ ±5% 0.125W 0805 Thick Film Chip Resistor AEC-Q200 compliant; Power Rating: 125mW; Temperature Coefficient: 200ppm/°C; Resistance: 10MR; Size Code: 0805; Resistor Type: Thick Film; RoHS Compliant: Yes; Max Operating Temperature: 155°C; Width: 0.049inch; Case/Package: 0805; Military Standard: Not; Max Power Dissipation: 125mW; Length: 2mm; Min Operating Temperature: -55°C; Tolerance: 5%; Height: 0.026inch; Depth: 1.25mm; Construction: Rectangular; Mount: Surface Mount; Radiation Hardening: No; Contact Plating: Tin; Case Code (Metric): 2012; Features: Automotive AEC-Q200; Case Code (Imperial): 0805; Packaging: Tape and Reel; Number of Terminations: 2; Lead Free: Lead Free; Series: RMCF
R27 R43 R49 R50 R52 R53 R57 = CMP-2000-07514-1: Chip Resistor, 0 Ohm, 0.125 W, -55 to 125 degC, 0805 (2012 Metric), RoHS, Tape and Reel; Manufacturer: TE Connectivity; Power Rating: 125mW; Voltage Rating: 150V; Tolerance: 0%; Case\/Package: 0805; Number of Resistors: 1; Resistance: 0mOhm; Datasheet URL: www.te.com/commerce/DocumentDelivery/DDEController?Action=showdoc&DocId=Customer+Drawing%7F1623401%7FBA%7Fpdf%7FEnglish%7FENG_CD_1623401_BA.pdf%7F1623401-1; Composition: ThickFilm; Max Operating Temperature: 125degC; Min Operating Temperature: -55degC; ELV: Compliant; Case Code (Metric): 2012; Number of Terminations: 2; Weight: 0.000194oz; Length: 2mm; Mount: SurfaceMount; Packaging: TapeandReel; Case Code (Imperial): 0805; RoHSCompliant: true; Width: 1.25mm; Radiation Hardening: No; Termination: Solder; Manufacturer URL: http://www.te.com/; Package Description: 2-Pin Surface Mount Device, Body 2 x 1.25 mm; Mounting Technology: SurfaceMount; Height: 0.55mm; Package Quantity: 5000; Package Reference: RESC2013X65X40L15T20; Datasheet Version: Rev. BA, 12/2009; Depth: 1.25mm
R29 R44 R47 R54 R66 R70 = CMP-2001-00337-1: Part Number: ERJ-6GEYJ103V; Manufacturer: Panasonic
R33 = CMP-2001-00447-1: Part Number: ERJ-6GEYJ752V; Manufacturer: Panasonic
R40 R41 = CMP-03412-049031-1: Thin Film Chip Resistors Automotive Grade 10kΩ 0.5% 50ppm/°C 0805; Max Power Dissipation: 125mW; Resistance: 10kR; Ratings: AEC-Q200; Length: 0.079inch; Temperature Coefficient: 50ppm/°C; Height: 0.024inch; Min Operating Temperature: -55°C; Case/Package: 0805; Tolerance: 0.5%; RoHS Compliant: Yes; Features: Moisture Resistant; Number of Terminations: 2; Max Operating Temperature: 155°C; Series: AT; Packaging: Tape and Reel; Width: 0.049inch; Resistor Type: Thin Film
R45 = CMP-02407-010572-1: RES 1.05K OHM 0.5% 1/5W 0805; Temperature Coefficient: 50ppm/°C; Resistance: 22kR; Tolerance: 1%; Length: 2mm; Lead Free: Lead Free; Packaging: Tape and Reel; Width: 1.25mm; Military Standard: Not; Composition: Thin Film; Case/Package: 0805; Max Operating Temperature: 125°C; Contact Plating: Tin; Min Operating Temperature: -55°C; Depth: 1.25mm; Radiation Hardening: No
R46 R48 = CMP-03412-008596-1: RT0805 10Ω 0.125W 10 ppm/°C 0.25%; Manufacturer: Yageo; Manufacturer Part Number: RT0805BRB1310RL; Voltage Rating: 150V; Tolerance: 0.0025; Composition: Thin Film; Ipc Land Pattern Name: RESC200125X50; Height: 0.6mm; Temperature Range Low: -55°C; RoHS: TRUE; Value: 10Ω; Device Class L2: Resistors; Resistance: 10Ω; Automotive: No; ComponentLink2Description: Datasheet; Footprint Url: http://www.yageo.com/exep/pages/download/literatures/PYu-R_Mount_10.pdf; Temperature: -55°C to +155°C; Package: RT0805; Series: RT; Device Class L1: Passive Components; Octopart: https://octopart.com/rt0805brb1310rl-yageo-73279041; Device Class L3: Chip SMD Resistors; Power Rating: 0.125W; Lead Free: Yes; Temperature Coefficient: 10 ppm/°C; ComponentLink2URL: http://www.yageo.com/documents/recent/PYu-RT_1-to-0.01_RoHS_L_9.pdf; Category: Res; Temperature Range High: +155°C
R51 = CMP-1013-00098-1: 10K 0.125W 5% 0805 (2012 Metric)  SMD; Case-EIA: 0805; Case-Metric: 2012; Value: 10000.00 Ohm; Power: 0.125 W; Technology: SMT; Tolerance: 5 %
R55 = CMP-02407-001361-1: RES 1.05K OHM 0.5% 1/5W 0805; Resistance: 1MR; Tolerance: 0.1%; Case/Package: 0805; Width: 1.25mm; Length: 2mm; Height: 450um; Lead Free: Lead Free
R58 = RMCF2010FT2R00: No Description Available; Manufacturer_Name: Stackpole International; Copyright: Copyright (C) 2026 Ultra Librarian. All rights reserved.; Manufacturer_Part_Number: RMCF2010FT2R00; Supplier 1: Arrow Electronics; Supplier Part Number 1: RMCF2010FT2R00
R59 R71 R73-R75 R77 = CMP-2001-01416-1: Manufacturer: Yageo; Part Number: RC0805JR-1310RL
R60 = RC2010JK-079K1L: RES SMD 9.1K OHM 5% 3/4W 2010; Package: None; Price: None; Value: *; MP: RC2010JK-079K1L; Availability: Unavailable; Supplier 1: Future Electronics; Supplier Part Number 1: 6184260
R62 R67 = CMP-2001-04899-2: RES Thick Film, 100kΩ, 1%, 0.125W, 100ppm/°C, 0805; Resistance: 100kR; Power Rating: 125mW; Voltage Rating: 150V; Case/Package: 0805; Max Operating Temperature: 155°C; Case Code (Imperial): 0805; Lead Free: Lead Free; Weight: 0.000194oz; Number of Pins: 2; Package Quantity: 5000; Height: 0.45mm; Composition: Thick Film; Military Standard: Not; Tolerance: 1%; Case Code (Metric): 2012; Termination: SMD/SMT; Mount: Surface Mount; Radiation Hardening: No; Width: 1.25mm; Length: 2mm; Depth: 1.25mm; Packaging: Tape and Reel; Min Operating Temperature: -55°C; Contact Plating: Tin; Temperature Coefficient: 100ppm/°C; Voltage Rating (DC): 150V
R63 = CMP-00030-39744854-1: WSL20101L000FEA18 Res Metal Strip 2010 0.001 Ohm 1% 1W ±275ppm/C Sulfur Resistant Pad SMD Automotive T/R; Resistance: 1mΩ; Temperature Coefficient: 275ppm/°C; Power Rating: 500mW; Max Power Dissipation: 1W; Features: Moisture Resistant; Number of Pins: 2010; Mount: Surface Mount; Radiation Hardening: No; Packaging: Cut Tape; REACH SVHC: Unknown; Tolerance: 1%; Depth: 2.54mm; Termination: SMD/SMT; NexarPartId: 39744854; Schedule B: 8533210045, 8533210045; Min Operating Temperature: -65°C; Contact Plating: Tin; Length: 5.08mm; Lead Free: Lead Free; Max Operating Temperature: 170°C; RoHS: Compliant; Case Code (Imperial): 2010; Width: 2.54mm; Case Code (Metric): 5025; Composition: Metal Element, Metal Strip; Height: 635µm; Number of Terminations: 2; Case/Package: 2010
R64 = RMCF2010FT140K: Part Reference: R20; Manufacturer Name: Stackpole Electronics Inc; OriginalSymbolOrigin: (-20000,10000); PCB Footprint: RESC5025X70N; Value: 140 k; Manufacturer Part Number: RMCF2010FT140K; Part Number: RMCF2010FT140K; Supplier 1: DigiKey; Supplier Part Number 1: 738-RMCF2010FT140KCT-ND
R65 R85 = RC1210JR-07100RL: 100 Ohms Â±5% 0.5W, 1/2W Chip Resistor 1210 (3225 Metric) Moisture Resistant Thick Film; MF: Yageo; SnapEDA_Link: https://www.snapeda.com/parts/RC1210JR-07100RL/Yageo/view-part/?ref=snap; Package: 3126 Yageo; Value: *; MP: RC1210JR-07100RL; Check_prices: https://www.snapeda.com/parts/RC1210JR-07100RL/Yageo/view-part/?ref=eda; Supplier 1: Avnet; Supplier Part Number 1: RC1210JR-07100RL
R68 = CMP-1018-00781-2: RES Thick Film, 261kΩ, 1%, 1W, 100ppm/°C, 2512; Voltage Rating (DC): 500V; Resistance: 261kR; Case Code (Metric): 6432; Max Power Dissipation: 1W; Number of Terminations: 2; Tolerance: 1%; Case Code (Imperial): 2512; Temperature Coefficient: 100ppm/°C; Width: 0.124inch; Packaging: Tape and Reel; Features: Automotive AEC-Q200; Composition: Thick Film; Mount: Surface Mount; Lead Free: Lead Free; Height: 0.028inch; Case/Package: 2512; Package Quantity: 2000; Power Rating: 1W; Length: 0.248inch
R69 = RC2010FK-07560KL: Part Reference: R23; Manufacturer Name: Yageo; OriginalSymbolOrigin: (-20000,10000); PCB Footprint: RESC5025X65N; Value: 560 k; Manufacturer Part Number: RC2010FK-07560KL; Part Number: RC2010FK-07560KL; Supplier 1: DigiKey; Supplier Part Number 1: 13-RC2010FK-07560KLCT-ND
R72 = CMP-03412-037656-1: RES SMD 820 OHM 1% 1/8W 0805; Manufacturer: Yageo; Manufacturer Part Number: AC0805FR-07820RL; Voltage Rating: 150V; Tolerance: 0.01; Automotive Grade: Grade 0; Category: Res; Temperature Range Low: -55°C; Lead Free: Yes; Composition: Thick Film; Device Class L1: Passive Components; ComponentLink2URL: http://www.yageo.com/documents/recent/PYu-AC_51_RoHS_L_6.pdf; Ipc Land Pattern Name: RESC200125X50; Series: AC; Package: AC0805; Device Class L2: Resistors; Value: 820Ω; Octopart: https://octopart.com/ac0805fr-07820rl-yageo-26041182; RoHS: TRUE; Temperature Range High: +155°C; Automotive: Yes; Mouser Description: Thick Film Resistors - SMD 1/8W 820ohm 1% AEC-Q200; ComponentLink2Description: Datasheet; Digikey Description: RES SMD 820 OHM 1% 1/8W 0805; Power Rating: 1/8W; Height: 0.6mm; Footprint Url: http://www.yageo.com/exep/pages/download/literatures/PYu-R_Mount_10.pdf; Temperature: -55°C to +155°C; Resistance: 820Ω; Device Class L3: Chip SMD Resistors
R76 R82 = CMP-00030-108211984-1: RCC08050000Z0EA Res Thick Film 0805 0 Ohm Conformal Coated Pad SMD Automotive AEC-Q200 T/R; Voltage Rating: 200V; Power Rating: 250mW; Resistance: 0Ω; Composition: Thick Film; Max Operating Temperature: 155°C; Case/Package: 0805; Height: 500µm; NexarPartId: 108211984; Min Operating Temperature: -55°C
R78 R83 R90 R91 = RC2010FK-07100KL: Part Reference: R54; Manufacturer Name: Yageo; OriginalSymbolOrigin: (-20000,10000); PCB Footprint: RESC5025X65N; Value: 100 k; Manufacturer Part Number: RC2010FK-07100KL; Part Number: RC2010FK-07100KL; Supplier 1: Newark; Supplier Part Number 1: RC2010FK-07100KL
R80 = CMP-04015-026884-1: 442Ω ±0.1% 0.125W, 1/8W Chip Resistor 0805 (2012 Metric) Moisture Resistant Thin Film
R86 = RC2010FK-071KL: Part Reference: R51; Manufacturer Name: Yageo; OriginalSymbolOrigin: (-20000,10000); PCB Footprint: RESC5025X65N; Value: 1 k; Manufacturer Part Number: RC2010FK-071KL; Part Number: RC2010FK-071KL; Supplier 1: DigiKey; Supplier Part Number 1: YAG3379CT-ND
R87 = RC2010FK-0722KL: Package: None; Price: None; Value: *; MP: RC2010FK-0722KL; Availability: Unavailable; Supplier 1: Future Electronics; Supplier Part Number 1: 5022018
RT1 RT2 = CMP-2000-05824-2: Thermistor NTC 10KOhm 1% 2-Pin; Resistance: 10kR; Lead Pitch: 2.54mm; Height: 2.4mm; Max Operating Temperature: 110°C; Width: 3.7mm; RoHS Compliant: Yes; Min Operating Temperature: -50°C; Termination: Radial; Packaging: Bulk; Number of Pins: 2; Series: AT; Tolerance: 1%; Length: 17mm
RT3 = CMP-06022-000215-2: NTC Thermistor for Temperature Sensor, Automotive, 0402, 10kΩ, 1%, 0.1mA, 5V
S1 = CMP-05618-000007-1: SWITCH TACTILE SPST-NO 0.05A 12V; Manufacturer: Panasonic; Operating Force: 2.2N; Contact Resistance: 500mΩ; Contact Current Rating: 50mA; Electromechanical Life: 100000Cycles; Device Class L2: Switches; Lead Free: Yes; Mount: Surface Mount; Digikey Description: SWITCH TACTILE SPST-NO 0.05A 12V; Temperature Range High: +70°C; Device Class L3: Tactile Switches; Package: EVQ-P7A01P; Voltage Rating Dc: 12V; Octopart: https://octopart.com/evq-p7a01p-panasonic-29917075; ComponentLink2URL: https://industrial.panasonic.com/cdbs/www-data/pdf/ATK0000/ATK0000C378.pdf; Automotive: No; Device Class L1: Electromechanical; Mouser Description: SWITCH TACTILE SPST-NO 0.05A 12V; Temperature: -20°C to +70°C; Manufacturer Part Number: EVQ-P7A01P; ComponentLink2Description: Datasheet; RoHS: TRUE; Category: Switch; Temperature Range Low: -20°C; Throw Configuration: SPST-NO; Height: 1.55mm
S2 = L101011ML04Q: Switch Slide ON OFF SPST Side Slide 4A 250VAC 125VDC PC Pins Thru-Hole Bulk; MF: C&K; SnapEDA_Link: https://www.snapeda.com/parts/L101011ML04Q/C%2526K/view-part/?ref=snap; Package: None; Value: *; MP: L101011ML04Q; Check_prices: https://www.snapeda.com/parts/L101011ML04Q/C%2526K/view-part/?ref=eda
U1 = CMP-04911-000083-1: 3-SERIES TO 10-SERIES MULTICELL
U2 = TPS62177DQCR: 28V, 0.5A Step-Down Converter with SNOOZE Mode 10-WSON -40 to 85; Manufacturer_Name: Texas Instruments; TYPE: TYPE; RefDes: RefDes; Copyright: Copyright (C) 2026 Ultra Librarian. All rights reserved.; Manufacturer_Part_Number: TPS62177DQCR; Supplier 1: Arrow Electronics; Supplier Part Number 1: TPS62177DQCR